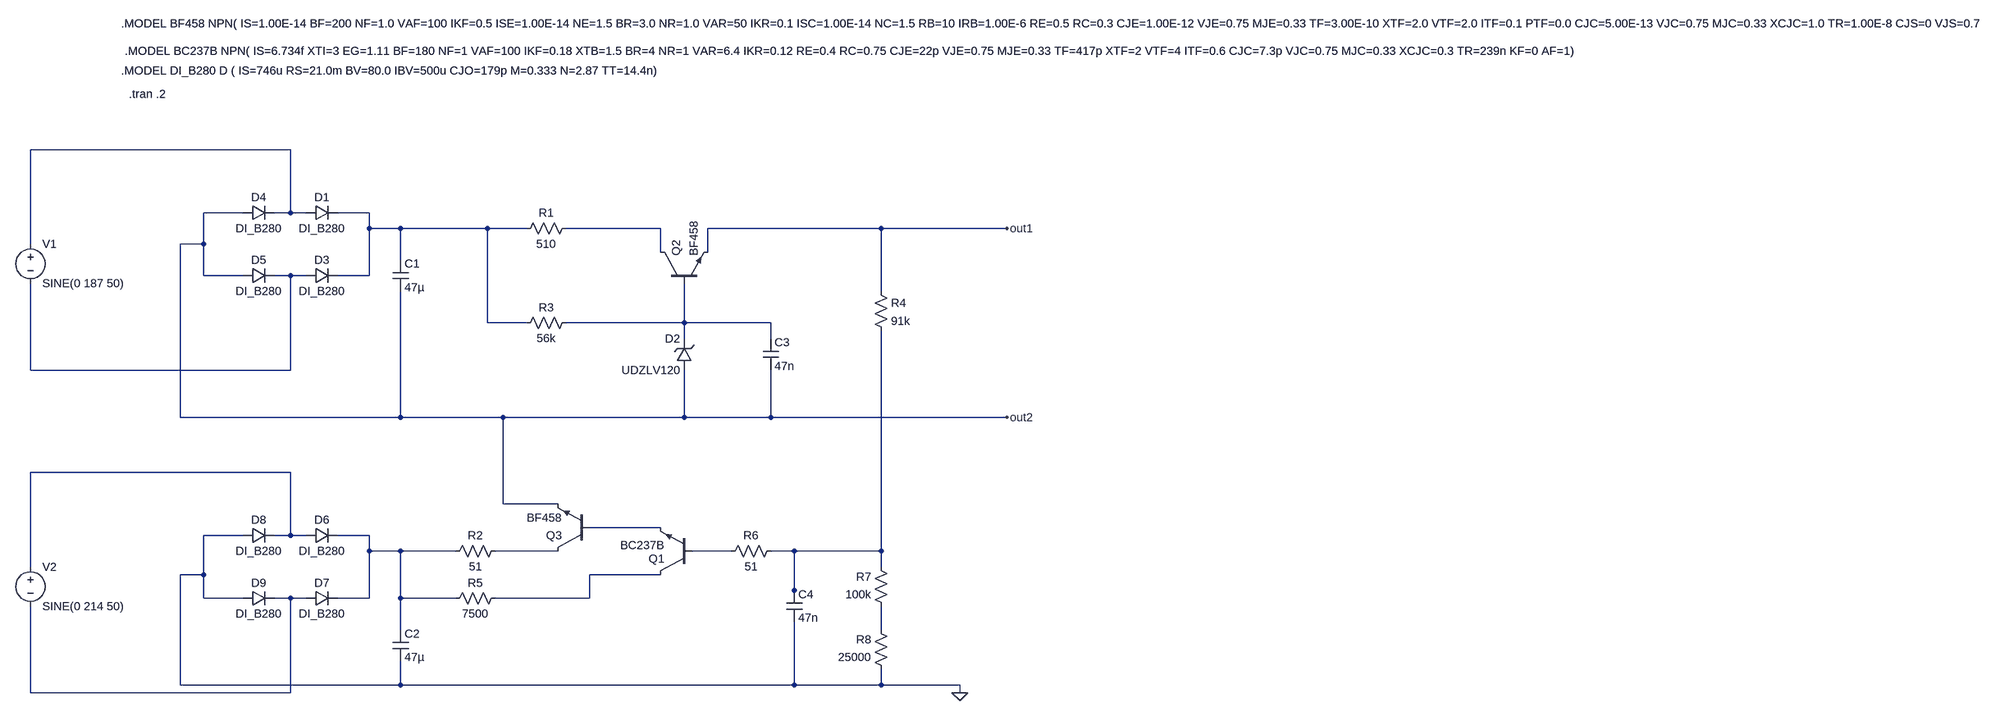
[diagram p0: schematic HM312-1.asc]
HM312-1.asc, the LTspice schematic file:
Version 4.1
SHEET 1 5348 1252
WIRE 1216 128 688 128
WIRE 1120 256 1040 256
WIRE 1216 256 1216 128
WIRE 1216 256 1184 256
WIRE 1248 256 1216 256
WIRE 1376 256 1312 256
WIRE 1376 288 1376 256
WIRE 1440 288 1376 288
WIRE 1616 288 1440 288
WIRE 1696 288 1616 288
WIRE 1968 288 1776 288
WIRE 2416 288 2064 288
WIRE 2672 288 2416 288
WIRE 688 320 688 128
WIRE 1040 320 1040 256
WIRE 1040 320 992 320
WIRE 1968 336 1968 288
WIRE 2064 336 2064 288
WIRE 1440 352 1440 288
WIRE 1040 384 1040 320
WIRE 1120 384 1040 384
WIRE 1216 384 1184 384
WIRE 1248 384 1216 384
WIRE 1376 384 1376 288
WIRE 1376 384 1312 384
WIRE 2416 416 2416 288
WIRE 1616 480 1616 288
WIRE 1696 480 1616 480
WIRE 2016 480 2016 400
WIRE 2016 480 1776 480
WIRE 2192 480 2016 480
WIRE 2016 512 2016 480
WIRE 2192 512 2192 480
WIRE 688 576 688 400
WIRE 1216 576 1216 384
WIRE 1216 576 688 576
WIRE 992 672 992 320
WIRE 1440 672 1440 416
WIRE 1440 672 992 672
WIRE 1648 672 1440 672
WIRE 2016 672 2016 576
WIRE 2016 672 1648 672
WIRE 2192 672 2192 576
WIRE 2192 672 2016 672
WIRE 2672 672 2192 672
WIRE 1216 784 688 784
WIRE 1648 848 1648 672
WIRE 1760 848 1648 848
WIRE 1968 896 1824 896
WIRE 1120 912 1040 912
WIRE 1216 912 1216 784
WIRE 1216 912 1184 912
WIRE 1248 912 1216 912
WIRE 1376 912 1312 912
WIRE 1376 944 1376 912
WIRE 1440 944 1376 944
WIRE 1552 944 1440 944
WIRE 1760 944 1632 944
WIRE 2112 944 2032 944
WIRE 2240 944 2192 944
WIRE 2416 944 2416 496
WIRE 2416 944 2240 944
WIRE 688 976 688 784
WIRE 2416 976 2416 944
WIRE 1040 992 1040 912
WIRE 1040 992 992 992
WIRE 1968 992 1824 992
WIRE 2240 1024 2240 944
WIRE 1040 1040 1040 992
WIRE 1120 1040 1040 1040
WIRE 1216 1040 1184 1040
WIRE 1248 1040 1216 1040
WIRE 1376 1040 1376 944
WIRE 1376 1040 1312 1040
WIRE 1440 1040 1440 944
WIRE 1552 1040 1440 1040
WIRE 1824 1040 1824 992
WIRE 1824 1040 1632 1040
WIRE 2240 1040 2240 1024
WIRE 1440 1104 1440 1040
WIRE 2416 1104 2416 1056
WIRE 992 1216 992 992
WIRE 1440 1216 1440 1168
WIRE 1440 1216 992 1216
WIRE 2240 1216 2240 1088
WIRE 2240 1216 1440 1216
WIRE 2416 1216 2416 1184
WIRE 2416 1216 2240 1216
WIRE 2576 1216 2416 1216
WIRE 688 1232 688 1056
WIRE 1216 1232 1216 1040
WIRE 1216 1232 688 1232
WIRE 2576 1232 2576 1216
FLAG 2576 1232 0
FLAG 2672 288 out1
FLAG 2672 672 out2
SYMBOL npn 2032 992 R180
WINDOW 3 56 60 Left 2
SYMATTR InstName Q1
SYMATTR Value BC237B
SYMBOL zener 2032 576 R180
WINDOW 0 24 64 Left 2
WINDOW 3 24 0 Left 2
SYMATTR InstName D2
SYMATTR Value UDZLV120
SYMBOL npn 1968 400 R270
SYMATTR InstName Q2
SYMATTR Value BF458
SYMBOL voltage 688 304 R0
WINDOW 123 0 0 Left 0
WINDOW 39 0 0 Left 0
SYMATTR InstName V1
SYMATTR Value SINE(0 187 50)
SYMBOL diode 1248 272 R270
WINDOW 0 32 32 VTop 2
WINDOW 3 0 32 VBottom 2
SYMATTR InstName D1
SYMATTR Value DI_B280
SYMBOL diode 1248 400 R270
WINDOW 0 32 32 VTop 2
WINDOW 3 0 32 VBottom 2
SYMATTR InstName D3
SYMATTR Value DI_B280
SYMBOL diode 1120 272 R270
WINDOW 0 32 32 VTop 2
WINDOW 3 0 32 VBottom 2
SYMATTR InstName D4
SYMATTR Value DI_B280
SYMBOL diode 1120 400 R270
WINDOW 0 32 32 VTop 2
WINDOW 3 0 32 VBottom 2
SYMATTR InstName D5
SYMATTR Value DI_B280
SYMBOL cap 1424 352 R0
SYMATTR InstName C1
SYMATTR Value 47µ
SYMATTR SpiceLine V=250 Irms=930m Rser=0.2769 Lser=10.521n mfg="Würth Elektronik" pn="860241180004 WCAP-AT1H 16x21" type="Al electrolytic"
SYMBOL voltage 688 960 R0
WINDOW 123 0 0 Left 0
WINDOW 39 0 0 Left 0
SYMATTR InstName V2
SYMATTR Value SINE(0 214 50)
SYMBOL diode 1248 928 R270
WINDOW 0 32 32 VTop 2
WINDOW 3 0 32 VBottom 2
SYMATTR InstName D6
SYMATTR Value DI_B280
SYMBOL diode 1248 1056 R270
WINDOW 0 32 32 VTop 2
WINDOW 3 0 32 VBottom 2
SYMATTR InstName D7
SYMATTR Value DI_B280
SYMBOL diode 1120 928 R270
WINDOW 0 32 32 VTop 2
WINDOW 3 0 32 VBottom 2
SYMATTR InstName D8
SYMATTR Value DI_B280
SYMBOL diode 1120 1056 R270
WINDOW 0 32 32 VTop 2
WINDOW 3 0 32 VBottom 2
SYMATTR InstName D9
SYMATTR Value DI_B280
SYMBOL cap 1424 1104 R0
SYMATTR InstName C2
SYMATTR Value 47µ
SYMATTR SpiceLine V=250 Irms=930m Rser=0.2769 Lser=10.521n mfg="Würth Elektronik" pn="860241180004 WCAP-AT1H 16x21" type="Al electrolytic"
SYMBOL res 1792 272 R90
WINDOW 0 0 56 VBottom 2
WINDOW 3 32 56 VTop 2
SYMATTR InstName R1
SYMATTR Value 510
SYMBOL res 1792 464 R90
WINDOW 0 0 56 VBottom 2
WINDOW 3 32 56 VTop 2
SYMATTR InstName R3
SYMATTR Value 56k
SYMBOL cap 2176 512 R0
SYMATTR InstName C3
SYMATTR Value 47n
SYMATTR SpiceLine V=250 Irms=930m Rser=0.2769 Lser=10.521n mfg="Würth Elektronik" pn="860241180004 WCAP-AT1H 16x21" type="Al electrolytic"
SYMBOL res 2400 400 R0
SYMATTR InstName R4
SYMATTR Value 91k
SYMBOL npn 1824 944 R180
SYMATTR InstName Q3
SYMATTR Value BF458
SYMBOL res 1648 928 R90
WINDOW 0 0 56 VBottom 2
WINDOW 3 32 56 VTop 2
SYMATTR InstName R2
SYMATTR Value 51
SYMBOL res 1648 1024 R90
WINDOW 0 0 56 VBottom 2
WINDOW 3 32 56 VTop 2
SYMATTR InstName R5
SYMATTR Value 7500
SYMBOL res 2208 928 R90
WINDOW 0 0 56 VBottom 2
WINDOW 3 32 56 VTop 2
SYMATTR InstName R6
SYMATTR Value 51
SYMBOL res 2432 1072 R180
WINDOW 0 36 76 Left 2
WINDOW 3 36 40 Left 2
SYMATTR InstName R7
SYMATTR Value 100k
SYMBOL res 2432 1200 R180
WINDOW 0 36 76 Left 2
WINDOW 3 36 40 Left 2
SYMATTR InstName R8
SYMATTR Value 25000
SYMBOL cap 2224 1024 R0
SYMATTR InstName C4
SYMATTR Value 47n
SYMATTR SpiceLine V=250 Irms=930m Rser=0.2769 Lser=10.521n mfg="Würth Elektronik" pn="860241180004 WCAP-AT1H 16x21" type="Al electrolytic"
TEXT 888 -160 Left 2 !.tran .2
TEXT 872 -304 Left 2 !.MODEL BF458 NPN( IS=1.00E-14 BF=200 NF=1.0 VAF=100 IKF=0.5 ISE=1.00E-14 NE=1.5 BR=3.0 NR=1.0 VAR=50 IKR=0.1 ISC=1.00E-14 NC=1.5 RB=10 IRB=1.00E-6 RE=0.5 RC=0.3 CJE=1.00E-12 VJE=0.75 MJE=0.33 TF=3.00E-10 XTF=2.0 VTF=2.0 ITF=0.1 PTF=0.0 CJC=5.00E-13 VJC=0.75 MJC=0.33 XCJC=1.0 TR=1.00E-8 CJS=0 VJS=0.75 MJS=0.0 XTB=0.0 EG=1.11 XTI=3.0)
TEXT 872 -208 Left 2 !.MODEL DI_B280 D ( IS=746u RS=21.0m BV=80.0 IBV=500u CJO=179p M=0.333 N=2.87 TT=14.4n)
TEXT 880 -248 Left 2 !.MODEL BC237B NPN( IS=6.734f XTI=3 EG=1.11 BF=180 NF=1 VAF=100 IKF=0.18 XTB=1.5 BR=4 NR=1 VAR=6.4 IKR=0.12 RE=0.4 RC=0.75 CJE=22p VJE=0.75 MJE=0.33 TF=417p XTF=2 VTF=4 ITF=0.6 CJC=7.3p VJC=0.75 MJC=0.33 XCJC=0.3 TR=239n KF=0 AF=1)

The netlist it stands for:
* HM312-1.asc
Q1 N012 N010 N007 0 BC237B
D2 out2 N005 UDZLV120
Q2 N003 N005 out1 0 BF458
V1 N001 N004 SINE(0 187 50)
D1 N001 N002 DI_B280
D3 N004 N002 DI_B280
D4 out2 N001 DI_B280
D5 out2 N004 DI_B280
C1 N002 out2 47µ V=250 Irms=930m Rser=0.2769 Lser=10.521n mfg="Würth Elektronik" pn="860241180004 WCAP-AT1H 16x21" type="Al electrolytic"
V2 N006 N013 SINE(0 214 50)
D6 N006 N008 DI_B280
D7 N013 N008 DI_B280
D8 0 N006 DI_B280
D9 0 N013 DI_B280
C2 N008 0 47µ V=250 Irms=930m Rser=0.2769 Lser=10.521n mfg="Würth Elektronik" pn="860241180004 WCAP-AT1H 16x21" type="Al electrolytic"
R1 N003 N002 510
R3 N005 N002 56k
C3 N005 out2 47n V=250 Irms=930m Rser=0.2769 Lser=10.521n mfg="Würth Elektronik" pn="860241180004 WCAP-AT1H 16x21" type="Al electrolytic"
R4 out1 N011 91k
Q3 N009 N007 out2 0 BF458
R2 N009 N008 51
R5 N012 N008 7500
R6 N011 N010 51
R7 N014 N011 100k
R8 0 N014 25000
C4 N011 0 47n V=250 Irms=930m Rser=0.2769 Lser=10.521n mfg="Würth Elektronik" pn="860241180004 WCAP-AT1H 16x21" type="Al electrolytic"
.model D D
.lib standard.dio
.model NPN NPN
.model PNP PNP
.lib standard.bjt
.tran .2
.MODEL BF458 NPN( IS=1.00E-14 BF=200 NF=1.0 VAF=100 IKF=0.5 ISE=1.00E-14 NE=1.5 BR=3.0 NR=1.0 VAR=50 IKR=0.1 ISC=1.00E-14 NC=1.5 RB=10 IRB=1.00E-6 RE=0.5 RC=0.3 CJE=1.00E-12 VJE=0.75 MJE=0.33 TF=3.00E-10 XTF=2.0 VTF=2.0 ITF=0.1 PTF=0.0 CJC=5.00E-13 VJC=0.75 MJC=0.33 XCJC=1.0 TR=1.00E-8 CJS=0 VJS=0.75 MJS=0.0 XTB=0.0 EG=1.11 XTI=3.0)
.MODEL DI_B280 D ( IS=746u RS=21.0m BV=80.0 IBV=500u CJO=179p M=0.333 N=2.87 TT=14.4n)
.MODEL BC237B NPN( IS=6.734f XTI=3 EG=1.11 BF=180 NF=1 VAF=100 IKF=0.18 XTB=1.5 BR=4 NR=1 VAR=6.4 IKR=0.12 RE=0.4 RC=0.75 CJE=22p VJE=0.75 MJE=0.33 TF=417p XTF=2 VTF=4 ITF=0.6 CJC=7.3p VJC=0.75 MJC=0.33 XCJC=0.3 TR=239n KF=0 AF=1)
.backanno
.end